# Altium project H2H Power Supply v1.1.PrjPCB
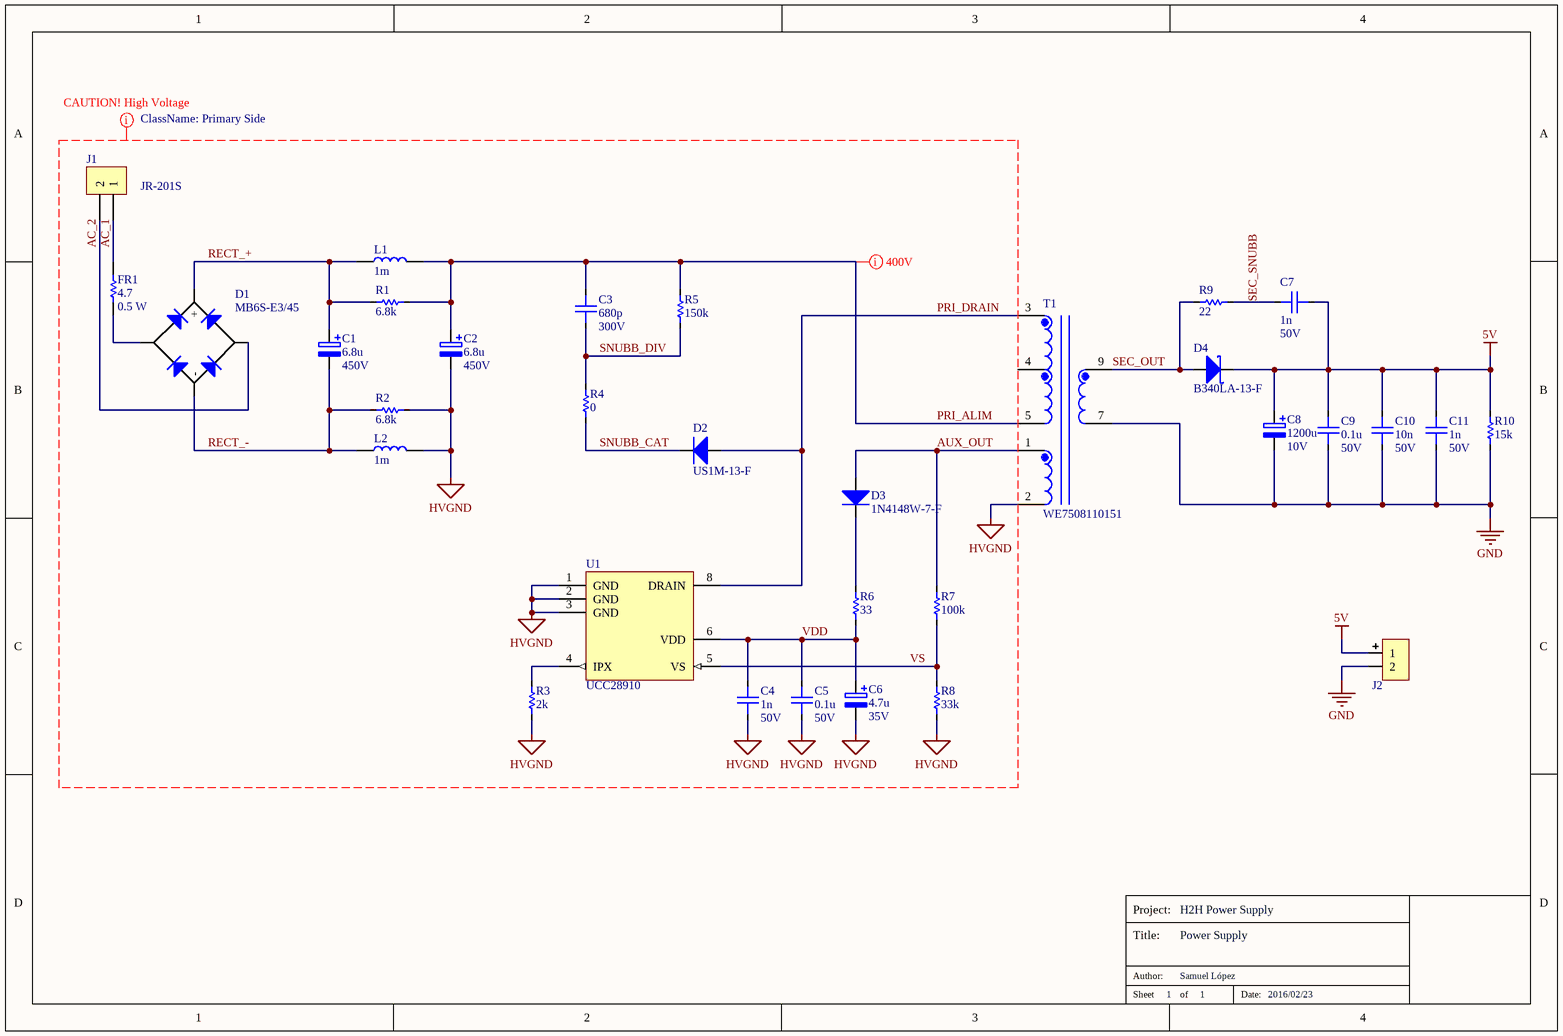
[diagram p0: Power Supply.SchDoc]
1 sheet, 32 parts. Net scope: global (net labels, ports and power ports of the same name join across sheets).
Board file: Power Supply.PcbDoc

## Sheet Power Supply.SchDoc: Power Supply
size A4; Date: 2016/02/23; Author: Samuel López; DocumentNumber: 1; SheetNumber: 1; SheetTotal: 1; Project: H2H Power Supply

### Parts
C1  6.8u  Rated Voltage: 450V  [450BXC6R8MEFC10X16]
C2  6.8u  Rated Voltage: 450V  [450BXC6R8MEFC10X16]
C3  680p  Rated Voltage: 300V  [C1206]
C4  1n  Rated Voltage: 50V  [C1206]
C5  0.1u  Rated Voltage: 50V  [C1206]
C6  4.7u  Rated Voltage: 35V  [EXV475M035A9BAA]
C7  1n  Rated Voltage: 50V  [C1206]
C8  1200u  Rated Voltage: 10V  [EEUFM1A122]
C9  0.1u  Rated Voltage: 50V  [C1206]
C10  10n  Rated Voltage: 50V  [C1206]
C11  1n  Rated Voltage: 50V  [C1206]
D1  MB6S-E3/45  [MB6S-E3/45]
D2  US1M-13-F  [US1M-13-F]
D3  1N4148W-7-F  [1N4148W-7-F]
D4  B340LA-13-F  [B340LA-13-F]
FR1  4.7  Power: 0.5 W  [NFR25H0004708JA500]
J1  JR-201S  [JR-201S]
J2  JST PH 2 Pin  [B2B-PH-K-S]  (value not drawn)
L1  1m  [DR0810-105L]
L2  1m  [DR0810-105L]
R1  6.8k  [R1206]
R2  6.8k  [R1206]
R3  2k  [R1206]
R4  0  [R1206]
R5  150k  [R1206]
R6  33  [R1206]
R7  100k  [R1206]
R8  33k  [R1206]
R9  22  [R1206]
R10  15k  [R1206]
T1  WE7508110151  [WE7508110151]
U1  UCC28910  [UCC28910]

### Nets
5V: C7.2 C8.1 C9.1 C10.1 C11.1 D4.2(K) J2.1 R10.1
GND: C8.2 C9.2 C10.2 C11.2 J2.2 R10.2 T1.7(Sec2)
HVGND: C2.2 C4.2 C5.2 C6.2 L2.2 R2.2 R3.2 R8.2 T1.2(Aux2) U1.1(GND) U1.2(GND) U1.3(GND)
AC_1: FR1.1 J1.1
AC_2: D1.2(AC) J1.2
AUX_OUT: D3.1(A) R7.1 T1.1(Aux1)
PRI_ALIM: C2.1 C3.1 L1.2 R1.2 R5.1 T1.5(Pri3)
PRI_DRAIN: D2.1(A) T1.3(Pri1) U1.8(DRAIN)
RECT_+: C1.1 D1.3(+) L1.1 R1.1
RECT_-: C1.2 D1.4(-) L2.1 R2.1
SEC_OUT: D4.1(A) R9.1 T1.9(Sec1)
SEC_SNUBB: C7.1 R9.2
SNUBB_CAT: D2.2(K) R4.2
SNUBB_DIV: C3.2 R4.1 R5.2
VDD: C4.1 C5.1 C6.1 R6.2 U1.6(VDD)
VS: R7.2 R8.1 U1.5(VS)
NetD1_1: D1.1(AC) FR1.2
NetD3_2: D3.2(K) R6.1
NetR3_1: R3.1 U1.4(IPX)

Not connected (* = marked no-connect by the designer): T1 4(Pri2)

### Layout directives
mark named 400V: PRI_ALIM
net class Primary Side: AC_1, AC_2, AUX_OUT, HVGND, PRI_ALIM, PRI_DRAIN, RECT_+, RECT_-, SNUBB_CAT, SNUBB_DIV, VDD, VS

### Notes on the sheet
- Project:
- Title:
- Sheet
- Author:
- of
- Date:

### Library data of the parts
C1 C2 = 450BXC6R8MEFC10X16: Capacitor - Electrolytic Capacitor, 6.8 uF, 450 V, 20%, 10 mm; Value: 6.8u; Supplier 1: Farnell; Supplier Part Number 1: 1831315
C3-C5 C7 C9-C11 = Capacitor
  C3: Value: 680p
  C4 C7 C11: Value: 1n
  C5 C9: Value: 0.1u
  C10: Value: 10n
C6 = EXV475M035A9BAA: Capacitor - Electrolytic Capacitor, SMD, 4.7 uF, 35 V, 4 mm; Value: 4.7u; Supplier 1: Farnell; Supplier Part Number 1: 2069186
C8 = EEUFM1A122: Capacitor - Electrolytic Capacitor, 1200 uF, 10 V, 20%, 10 mm; Value: 1200u; Supplier 1: Farnell; Supplier Part Number 1: 1848381
D1 = MB6S-E3/45: Diode - Bridge Rectifier, 600 V, 0.5 A; Supplier 1: Farnell; Supplier Part Number 1: 1815631
D2 = US1M-13-F: Diode - Ultra-fast, 75 ns, 1.7V, 1A, 1000V; Supplier 1: Digi-Key; Supplier Part Number 1: US1M-FDICT-ND
D3 = 1N4148W-7-F: Diode - Standard, Switch, 1.25V, 300mA, 100V; Supplier 1: Farnell; Supplier Part Number 1: 1776392
D4 = B340LA-13-F: Diode - Schottky, 450mV, 3A, 40V; Supplier 1: Farnell; Supplier Part Number 1: 1843681
FR1 = NFR25H0004708JA500: Resistor - Fusible, Non-flammable Resistor; Value: 4.7; Supplier 1: Farnell; Supplier Part Number 1: 9474080
J1 = JR-201S: Conn - 250 V AC, Inlet, IEC, Plug; Supplier 1: Farnell; Supplier Part Number 1: 9248161
J2 = B2B-PH-K-S: Conn - Battery, Male, 2 Pin, PCB; Supplier 1: Digi-Key; Supplier Part Number 1: 455-1704-ND
L1 L2 = DR0810-105L: Inductor - Power, 1 mH, 0.5 A Sat. Current, 10%; Saturation current: 500mA; Value: 1m; Supplier 1: Farnell; Supplier Part Number 1: 2457618
R1-R10 = Resistor: Power: *
  R1 R2: Value: 6.8k
  R3: Value: 2k
  R4: Value: 0
  R5: Value: 150k
  R6: Value: 33
  R7: Value: 100k
  R8: Value: 33k
  R9: Value: 22
  R10: Value: 15k
T1 = WE7508110151: Transformer - Flyback/Offline Transformer; Supplier 1: Digi-Key; Supplier Part Number 1: 1297-1122-ND
U1 = UCC28910: IC - SMPS Flyback, 700V Flyback Switcher with Constant-Voltage/Constant-Current and Primary-Side Control; Supplier 1: Digi-Key; Supplier Part Number 1: 296-37829-1-ND; Supplier 2: Farnell; Supplier Part Number 2: 2425775